# Altium project BEAGLEBONEBLK_C.PrjPcb
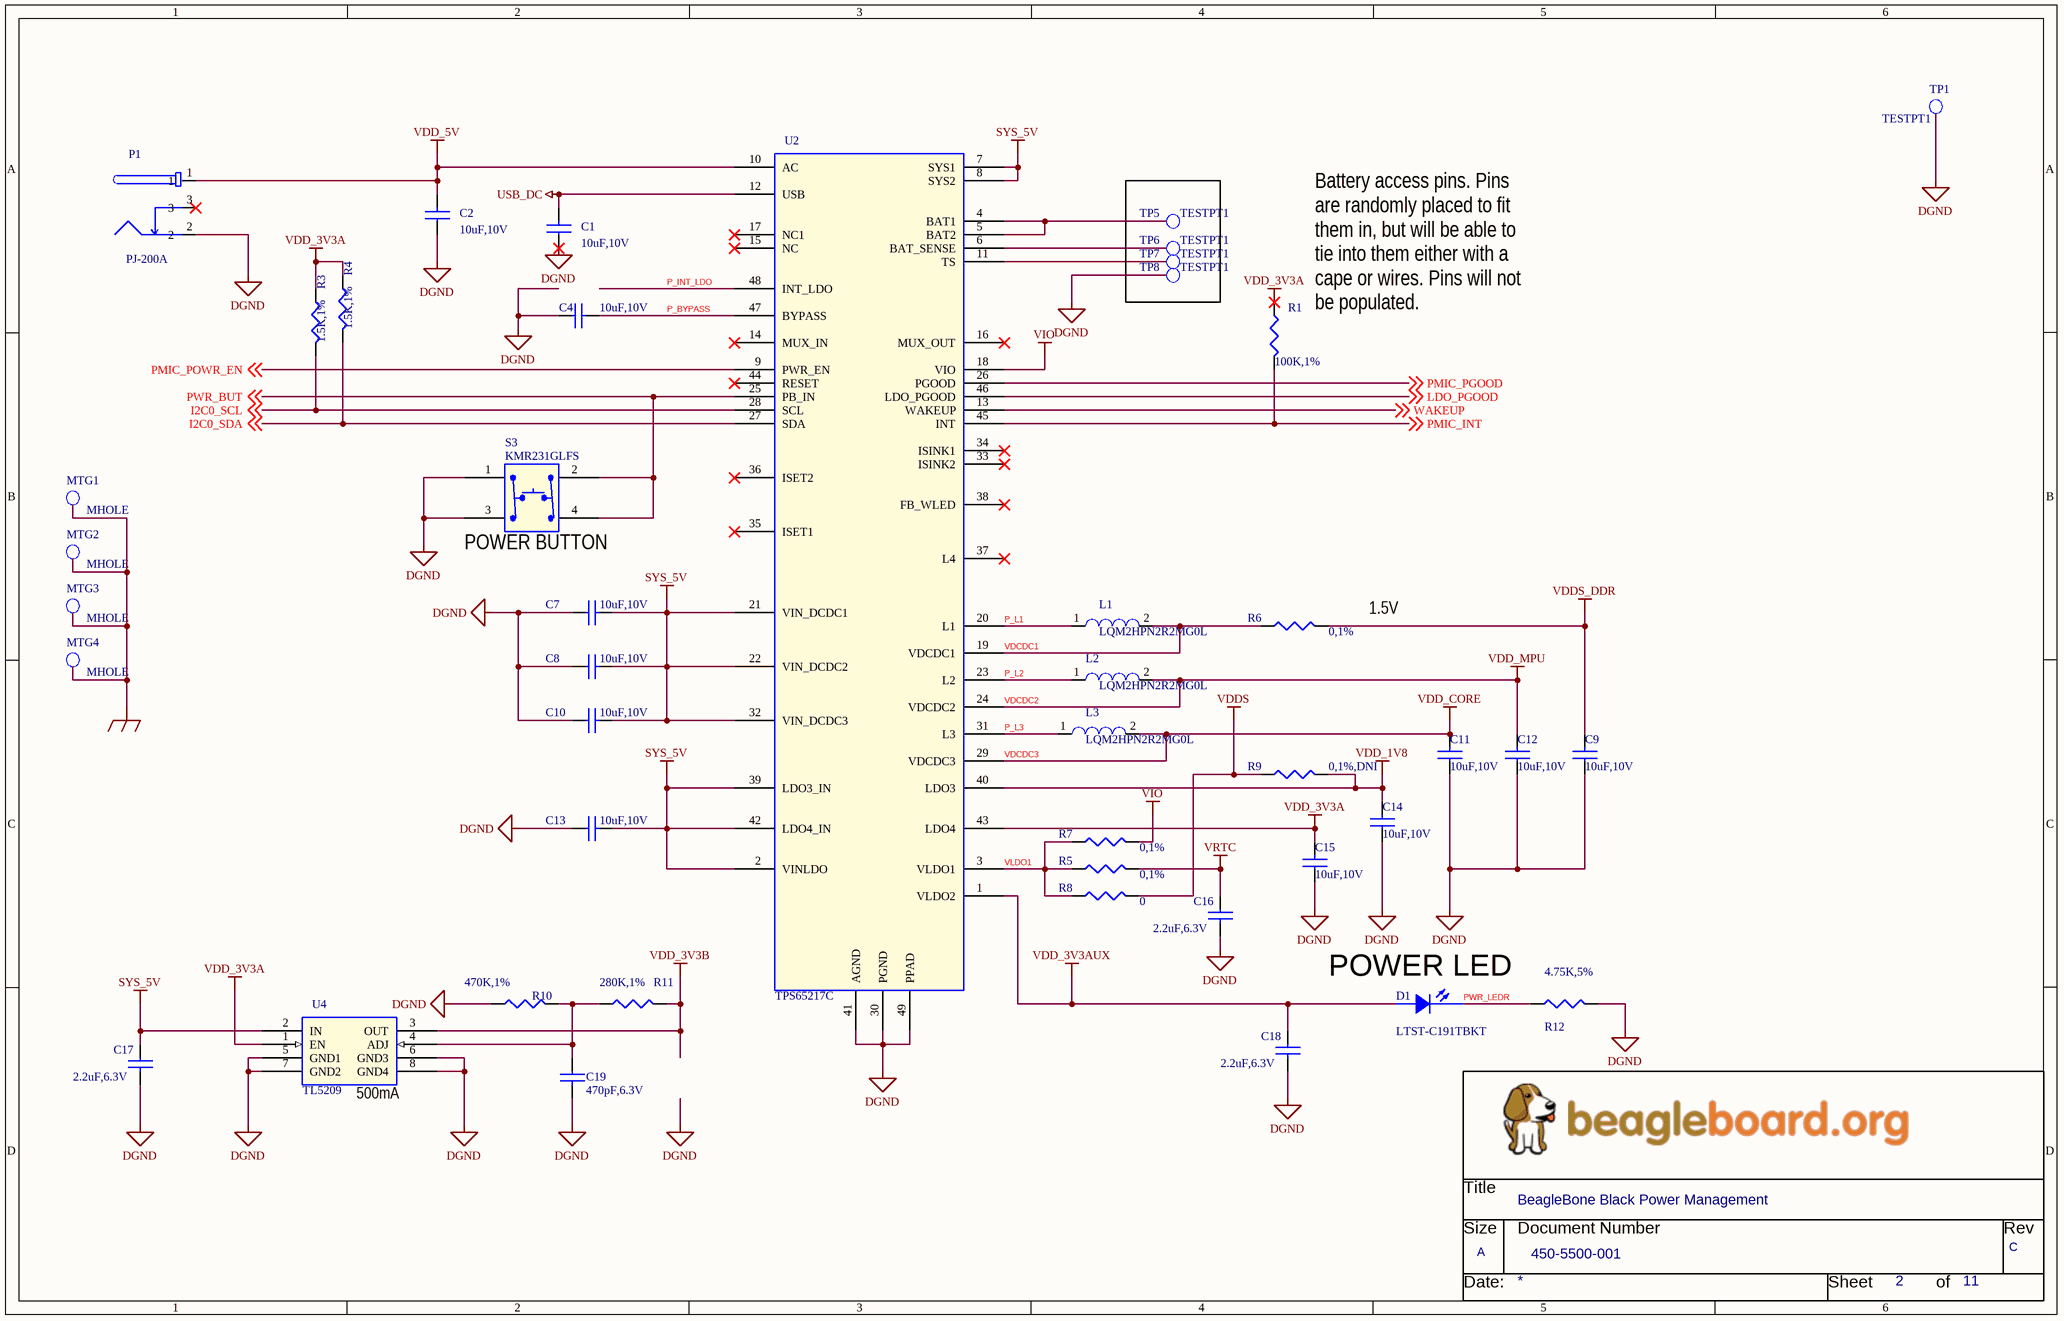
[diagram p0: P02_Power Management.SchDoc]
2 sheets, 75 parts. Net scope: global (net labels, ports and power ports of the same name join across sheets).
Sheets:
  P02_Power Management.SchDoc
  P04_AM335x 2_3, USB.SchDoc

## Sheet P02_Power Management.SchDoc
size 386 x 246 mm

### Parts
(Parts that share a designator on the sheet are numbered #1, #2 ... from top to bottom, then left to right.)
*#1  Page Count: 11  Page Number: 2  Page Size: A  Title: BeagleBone Black Power Management  RevCode: C  Doc: 450-5500-001  (hidden comment: BeagleBoard_org)  (graphical)
C1  10uF,10V  [r402-25rd]
C2  10uF,10V  [r402-25rd]
C4  10uF,10V  [r402-25rd]
C7  10uF,10V  [r402-25rd]
C8  10uF,10V  [r402-25rd]
C9  10uF,10V  [r402-25rd]
C10  10uF,10V  [r402-25rd]
C11  10uF,10V  [r402-25rd]
C12  10uF,10V  [r402-25rd]
C13  10uF,10V  [r402-25rd]
C14  10uF,10V  [r402-25rd]
C15  10uF,10V  [r402-25rd]
C16  2.2uF,6.3V  [402]
C17  2.2uF,6.3V  [402]
C18  2.2uF,6.3V  [402]
C19  470pF,6.3V  [402]
D1  LTST-C191TBKT  [led1206-59x59]
L1  LQM2HPN2R2MG0L  [VLCF5020T]
L2  LQM2HPN2R2MG0L  [VLCF5020T]
L3  LQM2HPN2R2MG0L  [VLCF5020T]
MTG1  MHOLE  [mh230-156]
MTG2  MHOLE  [mh230-156]
MTG3  MHOLE  [mh230-156]
MTG4  MHOLE  [mh230-156]
P1  PJ-200A  [CONN3-PWR-PJ102A]
R1  100K,1%  [402]
R3  1.5K,1%  [402]
R4  1.5K,1%  [402]
R5  0,1%  [402]
R6  0,1%  [402]
R7  0,1%  [402]
R8  0  [402]
R9  0,1%,DNI  [402]
R10  470K,1%  [402]
R11  280K,1%  [402]
R12  4.75K,5%  [402]
S3  KMR231GLFS  [SM-SW-SPST-4-4]
TP1  TESTPT1  [tp1-8040]
TP5  TESTPT1  [tp1-8040]
TP6  TESTPT1  [tp1-8040]
TP7  TESTPT1  [tp1-8040]
TP8  TESTPT1  [tp1-8040]
U2  TPS65217C  [TBD]
U4  TL5209  [SO8-25X75]

### Nets
DGND: C1.1 C2.1 C4.1 C7.1 C8.1 C9.1 C10.1 C11.1 C12.1 C13.1 C14.1 C15.1 C16.2 C17.2 C18.2 C19.2 P1.2 R10.2 R12.1 S3.1(A1) S3.3(A2) TP1.1(TP) TP8.1(TP) U2.30(PGND) U2.41(AGND) U2.49(PPAD) U4.5(GND1) U4.6(GND3) U4.7(GND2) U4.8(GND4)
GND_EARTH: MTG1.1(TP) MTG2.1(TP) MTG3.1(TP) MTG4.1(TP)
SYS_5V: C7.2 C8.2 C10.2 C13.2 C17.1 U2.2(VINLDO) U2.7(SYS1) U2.8(SYS2) U2.21(VIN_DCDC1) U2.22(VIN_DCDC2) U2.32(VIN_DCDC3) U2.39(LDO3_IN) U2.42(LDO4_IN) U4.2(IN)
USB_DC: C1.2 U2.12(USB)
VDCDC2: C12.2 L2.2 U2.24(VDCDC2)  [also labelled VDD_MPU]
VDCDC3: C11.2 L3.2 U2.29(VDCDC3)  [also labelled VDD_CORE]
VDD_1V8: C14.2 R9.2 U2.40(LDO3)
VDD_3V3A: C15.2 R1.1 R3.1 R4.1 U2.43(LDO4) U4.1(EN)
VDD_3V3AUX: C18.1 D1.2(A) U2.1(VLDO2)
VDD_3V3B: R11.1 U4.3(OUT)
VDD_5V: C2.2 P1.1 U2.10(AC)
VDDS: R8.2 R9.1
VDDS_DDR: C9.2 R6.2
VIO: R7.2 U2.18(VIO)
VRTC: C16.1 R5.2
I2C0_SCL: R3.2 U2.28(SCL) ; off-sheet I2C0_SCL
I2C0_SDA: R4.2 U2.27(SDA) ; off-sheet I2C0_SDA
LDO_PGOOD: U2.46(LDO_PGOOD) ; off-sheet LDO_PGOOD
P_BYPASS: C4.2 U2.47(BYPASS)
P_INT_LDO: U2.48(INT_LDO)
P_L1: L1.1 U2.20(L1)
P_L2: L2.1 U2.23(L2)
P_L3: L3.1 U2.31(L3)
PMIC_INT: R1.2 U2.45(INT) ; off-sheet PMIC_INT
PMIC_PGOOD: U2.26(PGOOD) ; off-sheet PMIC_PGOOD
PMIC_POWR_EN: U2.9(PWR_EN) ; off-sheet PMIC_POWR_EN
PWR_BUT: S3.2(B1) S3.4(B2) U2.25(PB_IN) ; off-sheet PWR_BUT
PWR_LEDR: D1.1(C) R12.2
VDCDC1: L1.2 R6.1 U2.19(VDCDC1)
VLDO1: R5.1 R7.1 R8.1 U2.3(VLDO1)
WAKEUP: U2.13(WAKEUP) ; off-sheet WAKEUP
NetC19_1: C19.1 R10.1 R11.2 U4.4(ADJ)
NetTP5_1: TP5.1(TP) U2.4(BAT1) U2.5(BAT2)
NetTP6_1: TP6.1(TP) U2.6(BAT_SENSE)
NetTP7_1: TP7.1(TP) U2.11(TS)

Not connected (* = marked no-connect by the designer): P1 3*; U2 14(MUX_IN)* 15(NC)* 16(MUX_OUT)* 17(NC1)* 33(ISINK2)* 34(ISINK1)* 35(ISET1)* 36(ISET2)* 37(L4)* 38(FB_WLED)* 44(RESET)*

### Notes on the sheet
- (near R1) Battery access pins. Pins
  are randomly placed to fit
  them in, but will be able to
  tie into them either with a
  cape or wires. Pins will not
  be populated.
- (near S3) POWER BUTTON
- 1.5V
- (near D1) POWER LED
- (near U4) 500mA
- (in symbol BeagleBoard_org) Title; Size; Document Number; Rev; Date:; Sheet; of

### Library data of the parts
C1 C2 C4 C7-C15 = CAP_10uF_Y5V_10V_10%_0805: Desc: CAP CER 10UF 10V Y5V 0805; PCB Footprint: 805; Part Number: CAP_10uF_Y5V_10V_10%_0805
C16-C18 = CAP_2.2uF_X5R_6.3V_10%_0402: Desc: CAP, CER, X7R, 0402, 50V, 10%, 0.1uF; Part Number: CAP_2.2uF_X5R_6.3V_10%_0402; PCB Footprint: 402
C19 = CAP_470PF_X7R_25V_10%_0402: Desc: Capacitor 470pF 25V 10% X7R; Part Number: CAP_470PF_X7R_25V_10%_0402; PCB Footprint: 402
D1 = LED_LTST-C150GKT_0: TN: 257-0020-000; CLASS: DISCRETE; PCB Footprint: LED_0603
L1-L3 = IND_2.2uH_2.6A_10%_SMD: Inductor 2.2uH smt 2.6A, 58 milliohm; TIIntPartnumber: 1L0025; MfrNum: VLCF5020T-2R2N2R6-3; Mfr: TDK; PartName: 2.2uH10%2.6Asmd; PCB Footprint: smd0.157inx0.157in; Cost10K: 0.37; Cost100: 1.11; Vendor: Digikey
MTG1-MTG4 = MHOLE: PCB Footprint: MTGH200C125D_PL
P1 = Power_Jack: PCB Footprint: CONN3-PWR-PJ102A
R1 = RES_100K_1/16W_1%_0402: Resistor 100Kohm 1/16W 1% 0402; Part Number: RES_100K_1/16W_1%_0402; PCB Footprint: 402
R3 R4 = RES_1.5K_1/16W_5%_0402_Dup1: RES 1.5K OHM 1/16W 5% 0402 SMD; Part Number: RES_1.5K_1/16W_5%_0402; PCB Footprint: 402
R5-R9 = RES_4.75K_1/16W_1%_0402: RES 4.75K OHM 1/16W 1% 0402 SMD; Part Number: RES_4.75K_1/16W_1%_0402; PCB Footprint: 402
R10-R12 = RES_470_1/10W_5%_0402: RES 470 OHM 1/10W 5% 0402 SMD; Part Number: RES_470_1/10W_5%_0402; PCB Footprint: 402
S3 = SW_KT11P2JM_2: CLASS: DISCRETE; TN: 276-0043-000; PCB Footprint: SW4SMD_63X161LS
TP5-TP8 = TESTPT1: PCB Footprint: TP60C33D
U2 = PWR_TPS65217_2: PCB Footprint: U_48_RSL
U4 = PWR_TLV70233DBV_0: PCB Footprint: SO8-25X75
*#1 = BeagleBoard_org: Page Create Date: March  8, 1995; Page Modify Date: *
TP1 = TESTPT1: PCB Footprint: tp1-8040

## Sheet P04_AM335x 2_3, USB.SchDoc
size 513 x 386 mm
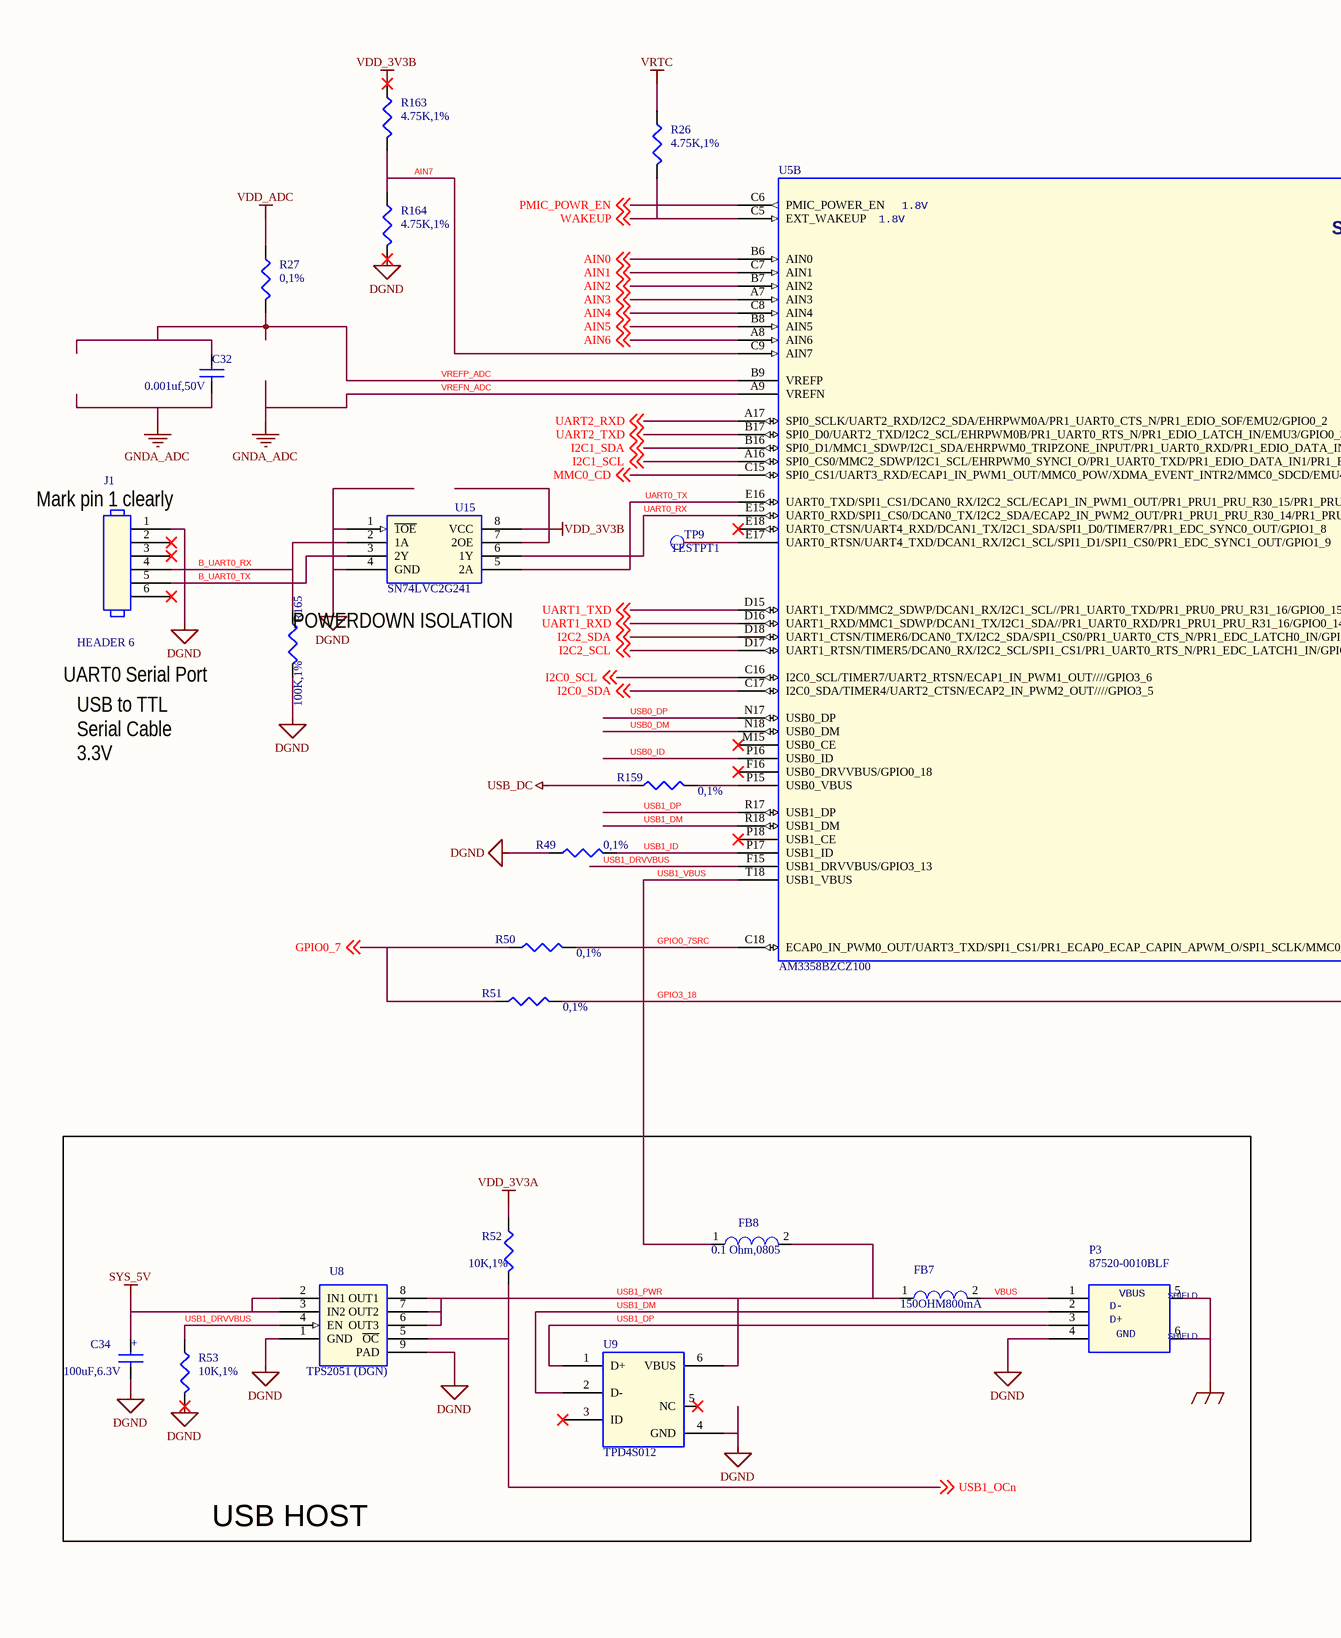
[diagram p1: P04_AM335x 2_3, USB.SchDoc, left]
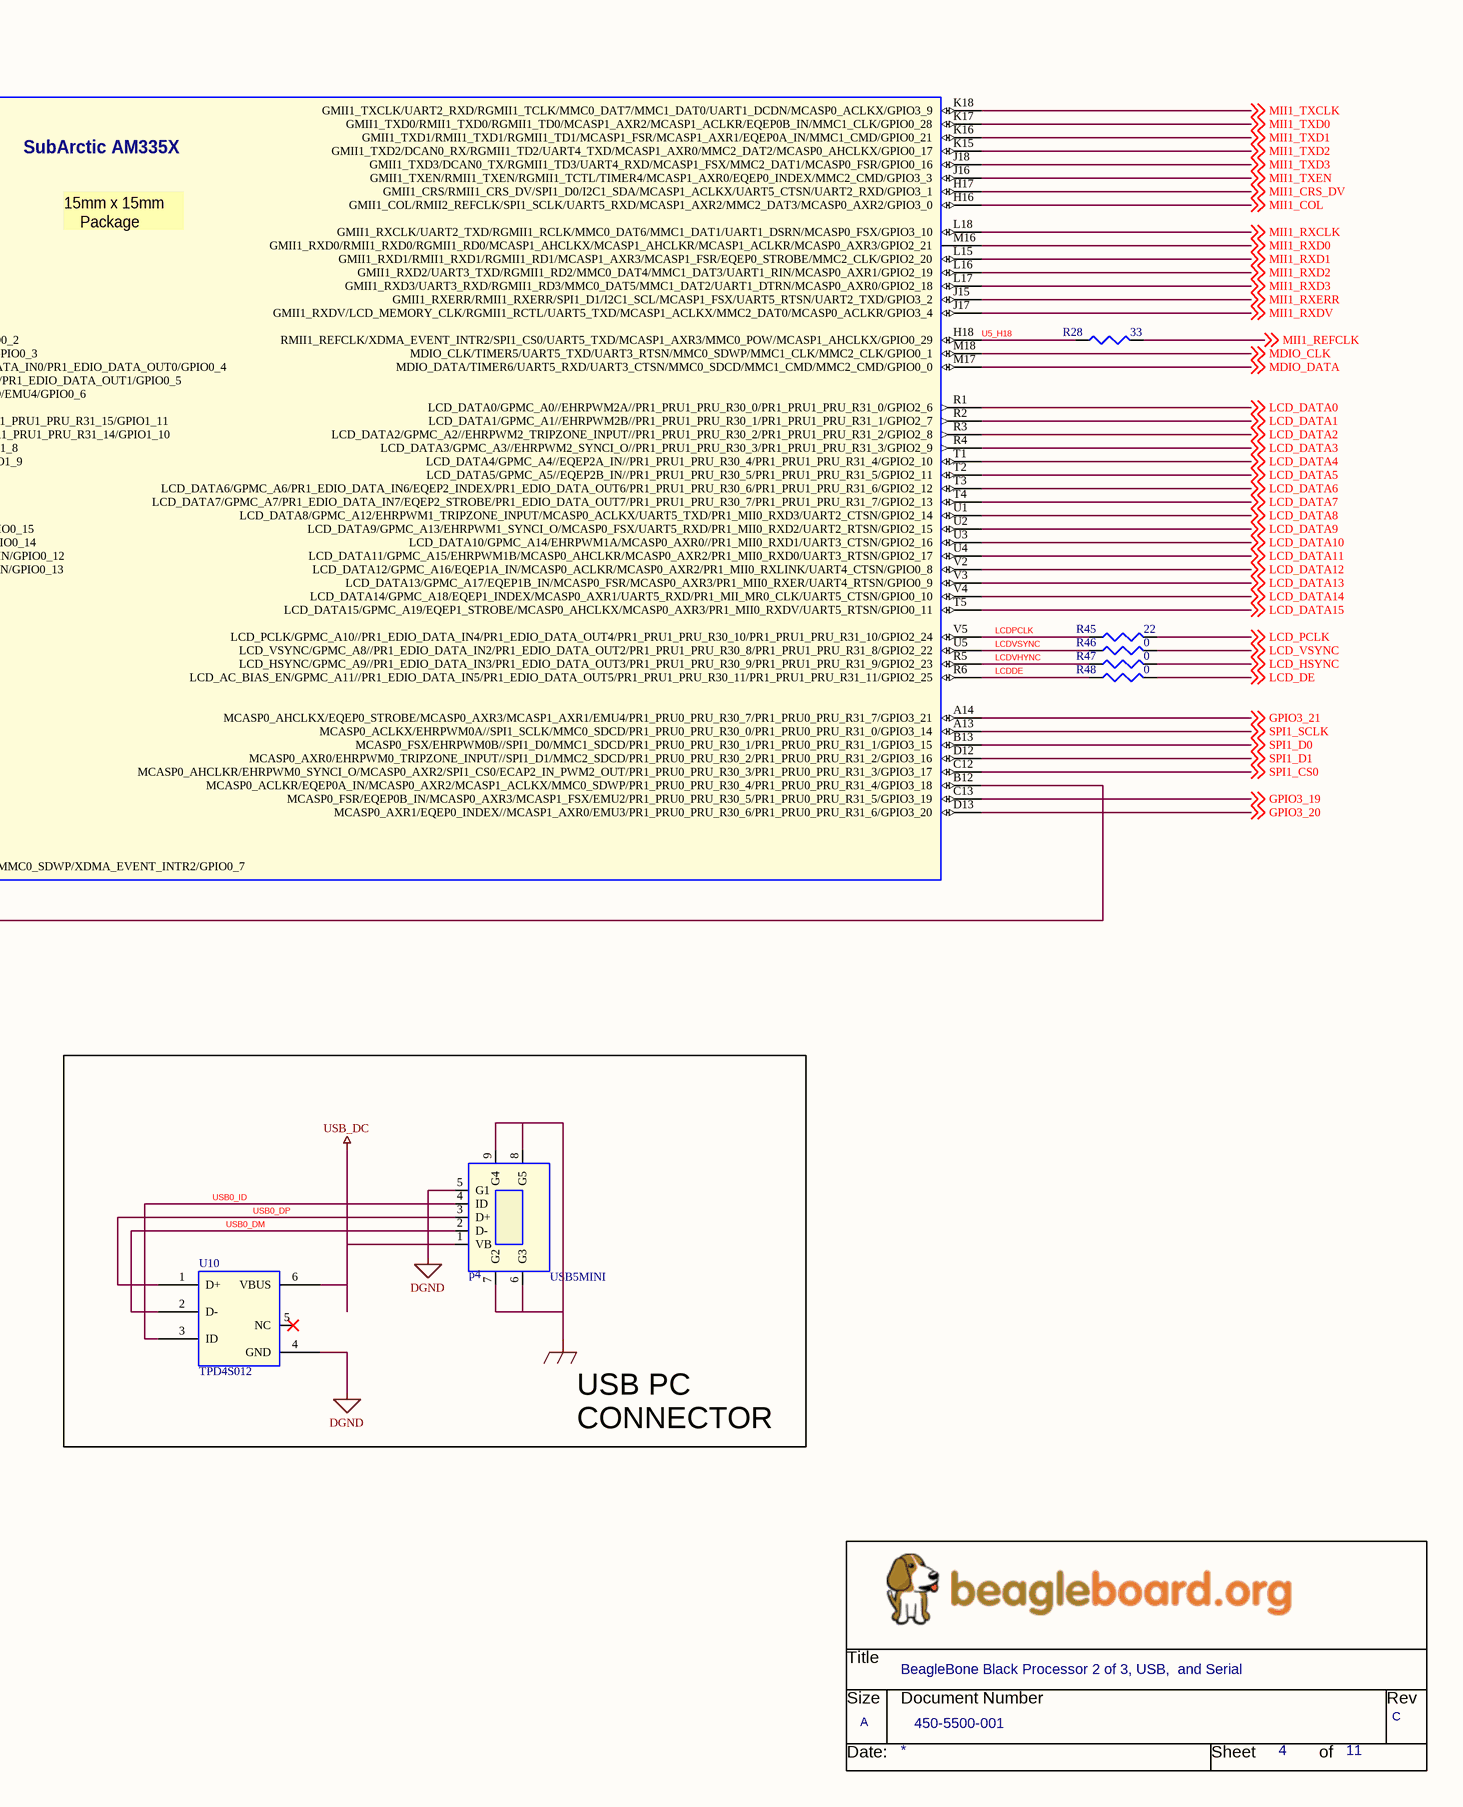
[diagram p2: P04_AM335x 2_3, USB.SchDoc, right]

### Parts
(Parts that share a designator on the sheet are numbered #1, #2 ... from top to bottom, then left to right.)
*#2  Page Count: 11  Page Number: 4  Page Size: A  Title: BeagleBone Black Processor 2 of 3, USB,  and Serial  RevCode: C  Doc: 450-5500-001  (hidden comment: BeagleBoard_org)  (graphical)
C32  0.001uf,50V  [402]
C34  100uF,6.3V  [r402-25rd]
FB7  150OHM800mA  [L0805]
FB8  0.1 Ohm,0805  [L0805]
J1  HEADER 6  [SIP6]
P3  87520-0010BLF  [MOL-54819-0578]
p4  USB5MINI  [usb-mini-smt-num]
R26  4.75K,1%  [402]
R27  0,1%  [402]
R28  33  [r402-25rd]
R45  22  [r402-25rd]
R46  0  [r402-25rd]
R47  0  [r402-25rd]
R48  0  [r402-25rd]
R49  0,1%  [402]
R50  0,1%  [402]
R51  0,1%  [402]
R52  10K,1%  [402]
R53  10K,1%  [402]
R159  0,1%  [402]
R163  4.75K,1%  [402]
R164  4.75K,1%  [402]
R165  100K,1%  [402]
TP9  TESTPT1  [tp1-8040]
U5  AM3358BZCZ100  [am33xx_15x15]  (part B of 3)
U8  TPS2051 (DGN)  [DGN-16X60]
U9  TPD4S012  [U_6_DRY]
U10  TPD4S012  [U_6_DRY]
U15  SN74LVC2G241  [U_8_DCU]

### Blocks framed on the sheet
USB HOST: C34 FB7 FB8 P3 R52 R53 U8 U9

### Nets
DGND: C34.2 J1.1 P3.4(P4) p4.5(G1) R49.1 R53.2 R164.2 R165.2 U8.1(GND) U8.9(PAD) U9.4(GND) U10.4(GND) U15.1(~{1OE}) U15.4(GND)
GND_EARTH: P3.5(SHELD1) P3.6(PAD4) p4.6(G3) p4.7(G2) p4.8(G5) p4.9(G4)
SYS_5V: C34.1 U8.2(IN1) U8.3(IN2)
USB_DC: p4.1(VB) R159.1 U10.6(VBUS)
VDD_3V3A: R52.1
VDD_3V3B: R163.1 U15.7(2OE) U15.8(VCC)
VDD_ADC: R27.1
VREFN_ADC: C32.2 U5.A9(VREFN)  [also labelled GNDA_ADC]
VRTC: R26.1
AIN0: U5.B6(AIN0) ; off-sheet AIN0
AIN1: U5.C7(AIN1) ; off-sheet AIN1
AIN2: U5.B7(AIN2) ; off-sheet AIN2
AIN3: U5.A7(AIN3) ; off-sheet AIN3
AIN4: U5.C8(AIN4) ; off-sheet AIN4
AIN5: U5.B8(AIN5) ; off-sheet AIN5
AIN6: U5.A8(AIN6) ; off-sheet AIN6
AIN7: R163.2 R164.1 U5.C9(AIN7)
B_UART0_RX: J1.4 R165.1 U15.2(1A)
B_UART0_TX: J1.5 U15.3(2Y)
GPIO0_7: R50.1 R51.1 ; off-sheet GPIO0_7
GPIO0_7SRC: R50.2 U5.C18(ECAP0_IN_PWM0_OUT/UART3_TXD/SPI1_CS1/PR1_ECAP0_ECAP_CAPIN_APWM_O/SPI1_SCLK/MMC0_SDWP/XDMA_EVENT_INTR2/GPIO0_7)
GPIO3_18: R51.2 U5.B12(MCASP0_ACLKR/EQEP0A_IN/MCASP0_AXR2/MCASP1_ACLKX/MMC0_SDWP/PR1_PRU0_PRU_R30_4/PR1_PRU0_PRU_R31_4/GPIO3_18)
GPIO3_19: U5.C13(MCASP0_FSR/EQEP0B_IN/MCASP0_AXR3/MCASP1_FSX/EMU2/PR1_PRU0_PRU_R30_5/PR1_PRU0_PRU_R31_5/GPIO3_19) ; off-sheet GPIO3_19
GPIO3_20: U5.D13(MCASP0_AXR1/EQEP0_INDEX//MCASP1_AXR0/EMU3/PR1_PRU0_PRU_R30_6/PR1_PRU0_PRU_R31_6/GPIO3_20) ; off-sheet GPIO3_20
GPIO3_21: U5.A14(MCASP0_AHCLKX/EQEP0_STROBE/MCASP0_AXR3/MCASP1_AXR1/EMU4/PR1_PRU0_PRU_R30_7/PR1_PRU0_PRU_R31_7/GPIO3_21) ; off-sheet GPIO3_21
I2C0_SCL: U5.C16(I2C0_SCL/TIMER7/UART2_RTSN/ECAP1_IN_PWM1_OUT////GPIO3_6) ; off-sheet I2C0_SCL
I2C0_SDA: U5.C17(I2C0_SDA/TIMER4/UART2_CTSN/ECAP2_IN_PWM2_OUT////GPIO3_5) ; off-sheet I2C0_SDA
I2C1_SCL: U5.A16(SPI0_CS0/MMC2_SDWP/I2C1_SCL/EHRPWM0_SYNCI_O/PR1_UART0_TXD/PR1_EDIO_DATA_IN1/PR1_EDIO_DATA_OUT1/GPIO0_5) ; off-sheet I2C1_SCL
I2C1_SDA: U5.B16(SPI0_D1/MMC1_SDWP/I2C1_SDA/EHRPWM0_TRIPZONE_INPUT/PR1_UART0_RXD/PR1_EDIO_DATA_IN0/PR1_EDIO_DATA_OUT0/GPIO0_4) ; off-sheet I2C1_SDA
I2C2_SCL: U5.D17(UART1_RTSN/TIMER5/DCAN0_RX/I2C2_SCL/SPI1_CS1/PR1_UART0_RTS_N/PR1_EDC_LATCH1_IN/GPIO0_13) ; off-sheet I2C2_SCL
I2C2_SDA: U5.D18(UART1_CTSN/TIMER6/DCAN0_TX/I2C2_SDA/SPI1_CS0/PR1_UART0_CTS_N/PR1_EDC_LATCH0_IN/GPIO0_12) ; off-sheet I2C2_SDA
LCD_DATA0: U5.R1(LCD_DATA0/GPMC_A0//EHRPWM2A//PR1_PRU1_PRU_R30_0/PR1_PRU1_PRU_R31_0/GPIO2_6) ; off-sheet LCD_DATA0
LCD_DATA1: U5.R2(LCD_DATA1/GPMC_A1//EHRPWM2B//PR1_PRU1_PRU_R30_1/PR1_PRU1_PRU_R31_1/GPIO2_7) ; off-sheet LCD_DATA1
LCD_DATA2: U5.R3(LCD_DATA2/GPMC_A2//EHRPWM2_TRIPZONE_INPUT//PR1_PRU1_PRU_R30_2/PR1_PRU1_PRU_R31_2/GPIO2_8) ; off-sheet LCD_DATA2
LCD_DATA3: U5.R4(LCD_DATA3/GPMC_A3//EHRPWM2_SYNCI_O//PR1_PRU1_PRU_R30_3/PR1_PRU1_PRU_R31_3/GPIO2_9) ; off-sheet LCD_DATA3
LCD_DATA4: U5.T1(LCD_DATA4/GPMC_A4//EQEP2A_IN//PR1_PRU1_PRU_R30_4/PR1_PRU1_PRU_R31_4/GPIO2_10) ; off-sheet LCD_DATA4
LCD_DATA5: U5.T2(LCD_DATA5/GPMC_A5//EQEP2B_IN//PR1_PRU1_PRU_R30_5/PR1_PRU1_PRU_R31_5/GPIO2_11) ; off-sheet LCD_DATA5
LCD_DATA6: U5.T3(LCD_DATA6/GPMC_A6/PR1_EDIO_DATA_IN6/EQEP2_INDEX/PR1_EDIO_DATA_OUT6/PR1_PRU1_PRU_R30_6/PR1_PRU1_PRU_R31_6/GPIO2_12) ; off-sheet LCD_DATA6
LCD_DATA7: U5.T4(LCD_DATA7/GPMC_A7/PR1_EDIO_DATA_IN7/EQEP2_STROBE/PR1_EDIO_DATA_OUT7/PR1_PRU1_PRU_R30_7/PR1_PRU1_PRU_R31_7/GPIO2_13) ; off-sheet LCD_DATA7
LCD_DATA8: U5.U1(LCD_DATA8/GPMC_A12/EHRPWM1_TRIPZONE_INPUT/MCASP0_ACLKX/UART5_TXD/PR1_MII0_RXD3/UART2_CTSN/GPIO2_14) ; off-sheet LCD_DATA8
LCD_DATA9: U5.U2(LCD_DATA9/GPMC_A13/EHRPWM1_SYNCI_O/MCASP0_FSX/UART5_RXD/PR1_MII0_RXD2/UART2_RTSN/GPIO2_15) ; off-sheet LCD_DATA9
LCD_DATA10: U5.U3(LCD_DATA10/GPMC_A14/EHRPWM1A/MCASP0_AXR0//PR1_MII0_RXD1/UART3_CTSN/GPIO2_16) ; off-sheet LCD_DATA10
LCD_DATA11: U5.U4(LCD_DATA11/GPMC_A15/EHRPWM1B/MCASP0_AHCLKR/MCASP0_AXR2/PR1_MII0_RXD0/UART3_RTSN/GPIO2_17) ; off-sheet LCD_DATA11
LCD_DATA12: U5.V2(LCD_DATA12/GPMC_A16/EQEP1A_IN/MCASP0_ACLKR/MCASP0_AXR2/PR1_MII0_RXLINK/UART4_CTSN/GPIO0_8) ; off-sheet LCD_DATA12
LCD_DATA13: U5.V3(LCD_DATA13/GPMC_A17/EQEP1B_IN/MCASP0_FSR/MCASP0_AXR3/PR1_MII0_RXER/UART4_RTSN/GPIO0_9) ; off-sheet LCD_DATA13
LCD_DATA14: U5.V4(LCD_DATA14/GPMC_A18/EQEP1_INDEX/MCASP0_AXR1/UART5_RXD/PR1_MII_MR0_CLK/UART5_CTSN/GPIO0_10) ; off-sheet LCD_DATA14
LCD_DATA15: U5.T5(LCD_DATA15/GPMC_A19/EQEP1_STROBE/MCASP0_AHCLKX/MCASP0_AXR3/PR1_MII0_RXDV/UART5_RTSN/GPIO0_11) ; off-sheet LCD_DATA15
LCD_DE: R48.2 ; off-sheet LCD_DE
LCD_HSYNC: R47.2 ; off-sheet LCD_HSYNC
LCD_PCLK: R45.2 ; off-sheet LCD_PCLK
LCD_VSYNC: R46.2 ; off-sheet LCD_VSYNC
LCDDE: R48.1 U5.R6(LCD_AC_BIAS_EN/GPMC_A11//PR1_EDIO_DATA_IN5/PR1_EDIO_DATA_OUT5/PR1_PRU1_PRU_R30_11/PR1_PRU1_PRU_R31_11/GPIO2_25)
LCDPCLK: R45.1 U5.V5(LCD_PCLK/GPMC_A10//PR1_EDIO_DATA_IN4/PR1_EDIO_DATA_OUT4/PR1_PRU1_PRU_R30_10/PR1_PRU1_PRU_R31_10/GPIO2_24)
LCDVHYNC: R47.1 U5.R5(LCD_HSYNC/GPMC_A9//PR1_EDIO_DATA_IN3/PR1_EDIO_DATA_OUT3/PR1_PRU1_PRU_R30_9/PR1_PRU1_PRU_R31_9/GPIO2_23)
LCDVSYNC: R46.1 U5.U5(LCD_VSYNC/GPMC_A8//PR1_EDIO_DATA_IN2/PR1_EDIO_DATA_OUT2/PR1_PRU1_PRU_R30_8/PR1_PRU1_PRU_R31_8/GPIO2_22)
MDIO_CLK: U5.M18(MDIO_CLK/TIMER5/UART5_TXD/UART3_RTSN/MMC0_SDWP/MMC1_CLK/MMC2_CLK/GPIO0_1) ; off-sheet MDIO_CLK
MDIO_DATA: U5.M17(MDIO_DATA/TIMER6/UART5_RXD/UART3_CTSN/MMC0_SDCD/MMC1_CMD/MMC2_CMD/GPIO0_0) ; off-sheet MDIO_DATA
MII1_COL: U5.H16(GMII1_COL/RMII2_REFCLK/SPI1_SCLK/UART5_RXD/MCASP1_AXR2/MMC2_DAT3/MCASP0_AXR2/GPIO3_0) ; off-sheet MII1_COL
MII1_CRS_DV: U5.H17(GMII1_CRS/RMII1_CRS_DV/SPI1_D0/I2C1_SDA/MCASP1_ACLKX/UART5_CTSN/UART2_RXD/GPIO3_1) ; off-sheet MII1_CRS_DV
MII1_REFCLK: R28.2 ; off-sheet MII1_REFCLK
MII1_RXCLK: U5.L18(GMII1_RXCLK/UART2_TXD/RGMII1_RCLK/MMC0_DAT6/MMC1_DAT1/UART1_DSRN/MCASP0_FSX/GPIO3_10) ; off-sheet MII1_RXCLK
MII1_RXD0: U5.M16(GMII1_RXD0/RMII1_RXD0/RGMII1_RD0/MCASP1_AHCLKX/MCASP1_AHCLKR/MCASP1_ACLKR/MCASP0_AXR3/GPIO2_21) ; off-sheet MII1_RXD0
MII1_RXD1: U5.L15(GMII1_RXD1/RMII1_RXD1/RGMII1_RD1/MCASP1_AXR3/MCASP1_FSR/EQEP0_STROBE/MMC2_CLK/GPIO2_20) ; off-sheet MII1_RXD1
MII1_RXD2: U5.L16(GMII1_RXD2/UART3_TXD/RGMII1_RD2/MMC0_DAT4/MMC1_DAT3/UART1_RIN/MCASP0_AXR1/GPIO2_19) ; off-sheet MII1_RXD2
MII1_RXD3: U5.L17(GMII1_RXD3/UART3_RXD/RGMII1_RD3/MMC0_DAT5/MMC1_DAT2/UART1_DTRN/MCASP0_AXR0/GPIO2_18) ; off-sheet MII1_RXD3
MII1_RXDV: U5.J17(GMII1_RXDV/LCD_MEMORY_CLK/RGMII1_RCTL/UART5_TXD/MCASP1_ACLKX/MMC2_DAT0/MCASP0_ACLKR/GPIO3_4) ; off-sheet MII1_RXDV
MII1_RXERR: U5.J15(GMII1_RXERR/RMII1_RXERR/SPI1_D1/I2C1_SCL/MCASP1_FSX/UART5_RTSN/UART2_TXD/GPIO3_2) ; off-sheet MII1_RXERR
MII1_TXCLK: U5.K18(GMII1_TXCLK/UART2_RXD/RGMII1_TCLK/MMC0_DAT7/MMC1_DAT0/UART1_DCDN/MCASP0_ACLKX/GPIO3_9) ; off-sheet MII1_TXCLK
MII1_TXD0: U5.K17(GMII1_TXD0/RMII1_TXD0/RGMII1_TD0/MCASP1_AXR2/MCASP1_ACLKR/EQEP0B_IN/MMC1_CLK/GPIO0_28) ; off-sheet MII1_TXD0
MII1_TXD1: U5.K16(GMII1_TXD1/RMII1_TXD1/RGMII1_TD1/MCASP1_FSR/MCASP1_AXR1/EQEP0A_IN/MMC1_CMD/GPIO0_21) ; off-sheet MII1_TXD1
MII1_TXD2: U5.K15(GMII1_TXD2/DCAN0_RX/RGMII1_TD2/UART4_TXD/MCASP1_AXR0/MMC2_DAT2/MCASP0_AHCLKX/GPIO0_17) ; off-sheet MII1_TXD2
MII1_TXD3: U5.J18(GMII1_TXD3/DCAN0_TX/RGMII1_TD3/UART4_RXD/MCASP1_FSX/MMC2_DAT1/MCASP0_FSR/GPIO0_16) ; off-sheet MII1_TXD3
MII1_TXEN: U5.J16(GMII1_TXEN/RMII1_TXEN/RGMII1_TCTL/TIMER4/MCASP1_AXR0/EQEP0_INDEX/MMC2_CMD/GPIO3_3) ; off-sheet MII1_TXEN
MMC0_CD: U5.C15(SPI0_CS1/UART3_RXD/ECAP1_IN_PWM1_OUT/MMC0_POW/XDMA_EVENT_INTR2/MMC0_SDCD/EMU4/GPIO0_6) ; off-sheet MMC0_CD
PMIC_POWR_EN: U5.C6(PMIC_POWER_EN) ; off-sheet PMIC_POWR_EN
SPI1_CS0: U5.C12(MCASP0_AHCLKR/EHRPWM0_SYNCI_O/MCASP0_AXR2/SPI1_CS0/ECAP2_IN_PWM2_OUT/PR1_PRU0_PRU_R30_3/PR1_PRU0_PRU_R31_3/GPIO3_17) ; off-sheet SPI1_CS0
SPI1_D0: U5.B13(MCASP0_FSX/EHRPWM0B//SPI1_D0/MMC1_SDCD/PR1_PRU0_PRU_R30_1/PR1_PRU0_PRU_R31_1/GPIO3_15) ; off-sheet SPI1_D0
SPI1_D1: U5.D12(MCASP0_AXR0/EHRPWM0_TRIPZONE_INPUT//SPI1_D1/MMC2_SDCD/PR1_PRU0_PRU_R30_2/PR1_PRU0_PRU_R31_2/GPIO3_16) ; off-sheet SPI1_D1
SPI1_SCLK: U5.A13(MCASP0_ACLKX/EHRPWM0A//SPI1_SCLK/MMC0_SDCD/PR1_PRU0_PRU_R30_0/PR1_PRU0_PRU_R31_0/GPIO3_14) ; off-sheet SPI1_SCLK
U5_H18: R28.1 U5.H18(RMII1_REFCLK/XDMA_EVENT_INTR2/SPI1_CS0/UART5_TXD/MCASP1_AXR3/MMC0_POW/MCASP1_AHCLKX/GPIO0_29)
UART0_RX: U5.E15(UART0_RXD/SPI1_CS0/DCAN0_TX/I2C2_SDA/ECAP2_IN_PWM2_OUT/PR1_PRU1_PRU_R30_14/PR1_PRU1_PRU_R31_14/GPIO1_10) U15.6(1Y)
UART0_TX: U5.E16(UART0_TXD/SPI1_CS1/DCAN0_RX/I2C2_SCL/ECAP1_IN_PWM1_OUT/PR1_PRU1_PRU_R30_15/PR1_PRU1_PRU_R31_15/GPIO1_11) U15.5(2A)
UART1_RXD: U5.D16(UART1_RXD/MMC1_SDWP/DCAN1_TX/I2C1_SDA//PR1_UART0_RXD/PR1_PRU1_PRU_R31_16/GPIO0_14) ; off-sheet UART1_RXD
UART1_TXD: U5.D15(UART1_TXD/MMC2_SDWP/DCAN1_RX/I2C1_SCL//PR1_UART0_TXD/PR1_PRU0_PRU_R31_16/GPIO0_15) ; off-sheet UART1_TXD
UART2_RXD: U5.A17(SPI0_SCLK/UART2_RXD/I2C2_SDA/EHRPWM0A/PR1_UART0_CTS_N/PR1_EDIO_SOF/EMU2/GPIO0_2) ; off-sheet UART2_RXD
UART2_TXD: U5.B17(SPI0_D0/UART2_TXD/I2C2_SCL/EHRPWM0B/PR1_UART0_RTS_N/PR1_EDIO_LATCH_IN/EMU3/GPIO0_3) ; off-sheet UART2_TXD
USB0_DM: p4.2(D-) U5.N18(USB0_DM) U10.2(D-)
USB0_DP: p4.3(D+) U5.N17(USB0_DP) U10.1(D+)
USB0_ID: p4.4(ID) U5.P16(USB0_ID) U10.3(ID)
USB1_DM: P3.2(P2) U5.R18(USB1_DM) U9.2(D-)
USB1_DP: P3.3(P3) U5.R17(USB1_DP) U9.1(D+)
USB1_DRVVBUS: R53.1 U5.F15(USB1_DRVVBUS/GPIO3_13) U8.4(EN)
USB1_ID: R49.2 U5.P17(USB1_ID)
USB1_OCn: R52.2 U8.5(~{OC}) ; off-sheet USB1_OCn
USB1_PWR: FB7.1 FB8.2 U8.6(OUT3) U8.7(OUT2) U8.8(OUT1) U9.6(VBUS)
USB1_VBUS: FB8.1 U5.T18(USB1_VBUS)
VBUS: FB7.2 P3.1(P1)
VREFP_ADC: C32.1 R27.2 U5.B9(VREFP)
WAKEUP: R26.2 U5.C5(EXT_WAKEUP) ; off-sheet WAKEUP
NetR159_2: R159.2 U5.P15(USB0_VBUS)
NetTP9_1: TP9.1(TP) U5.E17(UART0_RTSN/UART4_TXD/DCAN1_RX/I2C1_SCL/SPI1_D1/SPI1_CS0/PR1_EDC_SYNC1_OUT/GPIO1_9)

Not connected (* = marked no-connect by the designer): J1 2* 3* 6*; U5 E18(UART0_CTSN/UART4_RXD/DCAN1_TX/I2C1_SDA/SPI1_D0/TIMER7/PR1_EDC_SYNC0_OUT/GPIO1_8)* F16(USB0_DRVVBUS/GPIO0_18)* M15(USB0_CE)* P18(USB1_CE)*; U9 3(ID)* 5(NC)*; U10 5(NC)*

### Notes on the sheet
- (near J1) Mark pin 1 clearly
- (near R165) POWERDOWN ISOLATION
- UART0 Serial Port
- USB to TTL
  Serial Cable
  3.3V
- USB PC
  CONNECTOR
- (in symbol BeagleBoard_org) Title; Size; Document Number; Rev; Date:; Sheet; of
- (in symbol CAP_100UF_TANT_6.3V_3528-21) +
- (in symbol CONN_54819-0578_2) VBUS; SHIELD; D-; D+; GND
- (in symbol IC_AM335X_ZCZ, part B) 1.8V; SubArctic AM335X; 15mm x 15mm / Package

### Library data of the parts
C32 = CAP_0.001_X7R_50V_5%_0402: Part Number: CAP_0.001uf_X7R_50V_0402; Desc: Capacitor 0.001uF 50V 5% 0402; PCB Footprint: 402
C34 = CAP_100UF_TANT_6.3V_3528-21: Desc: CAP CER 100UF 10V Y5V 0805; PCB Footprint: RD205SMD_250D; Part Number: CAP_100uF_TANT_6.3V_3528-21
FB7 FB8 = FER_180_200_0: Ferrite Bead 150 Ohm 800mA; Part Number: FER_180_200_0805; TIIntPartnumber: 1L0010; MfrNum: LI0805H151R-10; Mfr: Steward; PCB Footprint: 805; Vendor: Digikey; PartName: FerriteBead150ohm800mA
P3 = CONN_54819-0578_2: TN: 224-0234-000; CLASS: IO; PCB Footprint: USB_A_SH
p4 = MINI-USB-AB-SOCKET: Manufacturer: KYCON; Order#: KMAB-SMT-5S-S-30TR; ATLStockNo1: 4500.0223; Order# 2: C-440247; PCB Footprint: USB5MINI_4SHIELDED_SMD-5; Distributor 2: Tyco; Distributor: Deltron; Manufacturer 2: AMP
R26 R50 R51 R159 R163 R164 = RES_4.75K_1/16W_1%_0402: RES 4.75K OHM 1/16W 1% 0402 SMD; Part Number: RES_4.75K_1/16W_1%_0402; PCB Footprint: 402
R27 = RES_0_1/16W_1%_0402_Dup1: Resistor Zero ohm Jumper 0402; Part Number: RES_0_1/16W_1%_0402; PCB Footprint: 402
R28 R45-R48 = RES_33_0402: PCB Footprint: 0402; Part Number: RES_33_0402
R49 R165 = RES_100K_1/16W_1%_0402: Resistor 100Kohm 1/16W 1% 0402; Part Number: RES_100K_1/16W_1%_0402; PCB Footprint: 402
R52 R53 = RES_10K_1/16W_1%_0402_Dup1: Resistor 10Kohm 1/16W 1% 0402; Part Number: RES_10K_1/16W_1%_0402; PCB Footprint: 402
TP9 = TESTPT1: PCB Footprint: TP60C33D
U5 = IC_AM335X_ZCZ: SubArctic Cortex A8 Processor 15x15; Part Number: IC_AM335x_ZCE; TIIntPartnumber: 1A0242; MfrNum: AM335x 15x15 FBGA ZCE; Mfr: TI; PartName: AM335X_15x15; PCB Footprint: FBGAZCZ15x15_tbd; Vendor: Arrow; Cost10K: 10.00; Cost100: 10.00
U8 = TPS2061_1: PCB Footprint: DGN-16X60
U9 U10 = PROT_TPD4S012: ESD 4channel USB Interface; TIIntPartnumber: 1A0233; MfrNum: TPD4S012DRY; Mfr: TI; PCB Footprint: smd UFDFN-6pin; Cost10K: 0.23; Cost100: 0.76; Vendor: Digikey; PartName: TPD4S012
U15 = IC_SN74LVC2G241_1: PCB Footprint: U_8_DCU
*#2 = BeagleBoard_org: Page Create Date: March  8, 1995; Page Modify Date: *
J1 = HEADER 6: PCB Footprint: SIP6

## Nets that join several sheets
DGND: P02_Power Management (30 pins), P04_AM335x 2_3, USB (14 pins)
GND_EARTH: P02_Power Management (MTG1.1 MTG2.1 MTG3.1 MTG4.1), P04_AM335x 2_3, USB (6 pins)
SYS_5V: P02_Power Management (14 pins), P04_AM335x 2_3, USB (C34.1 U8.2 U8.3)
USB_DC: P02_Power Management (C1.2 U2.12), P04_AM335x 2_3, USB (p4.1 R159.1 U10.6)
VDD_3V3A: P02_Power Management (6 pins), P04_AM335x 2_3, USB (R52.1)
VDD_3V3B: P02_Power Management (R11.1 U4.3), P04_AM335x 2_3, USB (R163.1 U15.7 U15.8)
VRTC: P02_Power Management (C16.1 R5.2), P04_AM335x 2_3, USB (R26.1)
I2C0_SCL: P02_Power Management (R3.2 U2.28), P04_AM335x 2_3, USB (U5.C16)
I2C0_SDA: P02_Power Management (R4.2 U2.27), P04_AM335x 2_3, USB (U5.C17)
PMIC_POWR_EN: P02_Power Management (U2.9), P04_AM335x 2_3, USB (U5.C6)
WAKEUP: P02_Power Management (U2.13), P04_AM335x 2_3, USB (R26.2 U5.C5)